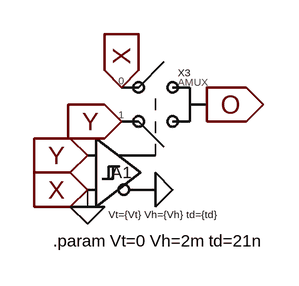
[diagram p0: schematic amux-max.asc]
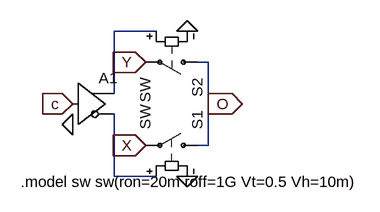
[diagram p1: sub-circuit amux-2to1.asc]
amux-max.asc, the LTspice schematic file:
Version 4
SHEET 1 880 680
FLAG 16 -64 X
IOPIN 16 -64 In
FLAG 16 -32 Y
IOPIN 16 -32 In
FLAG 96 -48 O
IOPIN 96 -48 Out
FLAG -16 0 Y
IOPIN -16 0 In
FLAG -16 32 X
IOPIN -16 32 In
FLAG -16 48 0
FLAG 48 32 0
SYMBOL amux-2to1 48 -32 R0
SYMATTR InstName X3
SYMBOL Digital\\diffschmitt -16 -48 R0
WINDOW 0 32 64 Center 1
WINDOW 3 20 103 Left 0
SYMATTR InstName A1
SYMATTR Value Vt={Vt} Vh={Vh} td={td}
TEXT -48 80 Left 1 !.param Vt=0 Vh=2m td=21n

amux-2to1.asc, the sub-circuit schematic file:
Version 4
SHEET 1 880 680
WIRE 64 -160 0 -160
WIRE 144 -112 128 -112
WIRE 0 -64 0 -160
WIRE 144 -48 144 -112
WIRE 144 16 144 -48
WIRE 144 16 128 16
WIRE 0 64 0 -32
WIRE 64 64 0 64
FLAG 112 64 0
FLAG -64 -48 c
IOPIN -64 -48 In
FLAG 112 -160 0
FLAG 48 16 X
IOPIN 48 16 In
FLAG 48 -112 Y
IOPIN 48 -112 In
FLAG 144 -48 O
IOPIN 144 -48 Out
FLAG -64 -16 0
SYMBOL sw 144 16 M270
SYMATTR InstName S1
SYMBOL sw 144 -112 R90
SYMATTR InstName S2
SYMBOL Digital\\buf -64 -112 R0
SYMATTR InstName A1
TEXT -144 72 Left 0 !.model sw sw(ron=20m roff=1G Vt=0.5 Vh=10m)

The netlist it stands for:
* amux-max.asc
XX3 P001 O X Y amux-2to1
A1 Y X 0 0 0 0 P001 0 SCHMITT Vt={Vt} Vh={Vh} td={td}

* block symbol definitions
.subckt amux-2to1 c O X Y
S1 O X N002 0 SW
S2 O Y N001 0 SW
A1 c 0 0 0 0 N002 N001 0 BUF
.model sw sw(ron=20m roff=1G Vt=0.5 Vh=10m)
.ends amux-2to1

.param Vt=0 Vh=2m td=21n
.backanno
.end